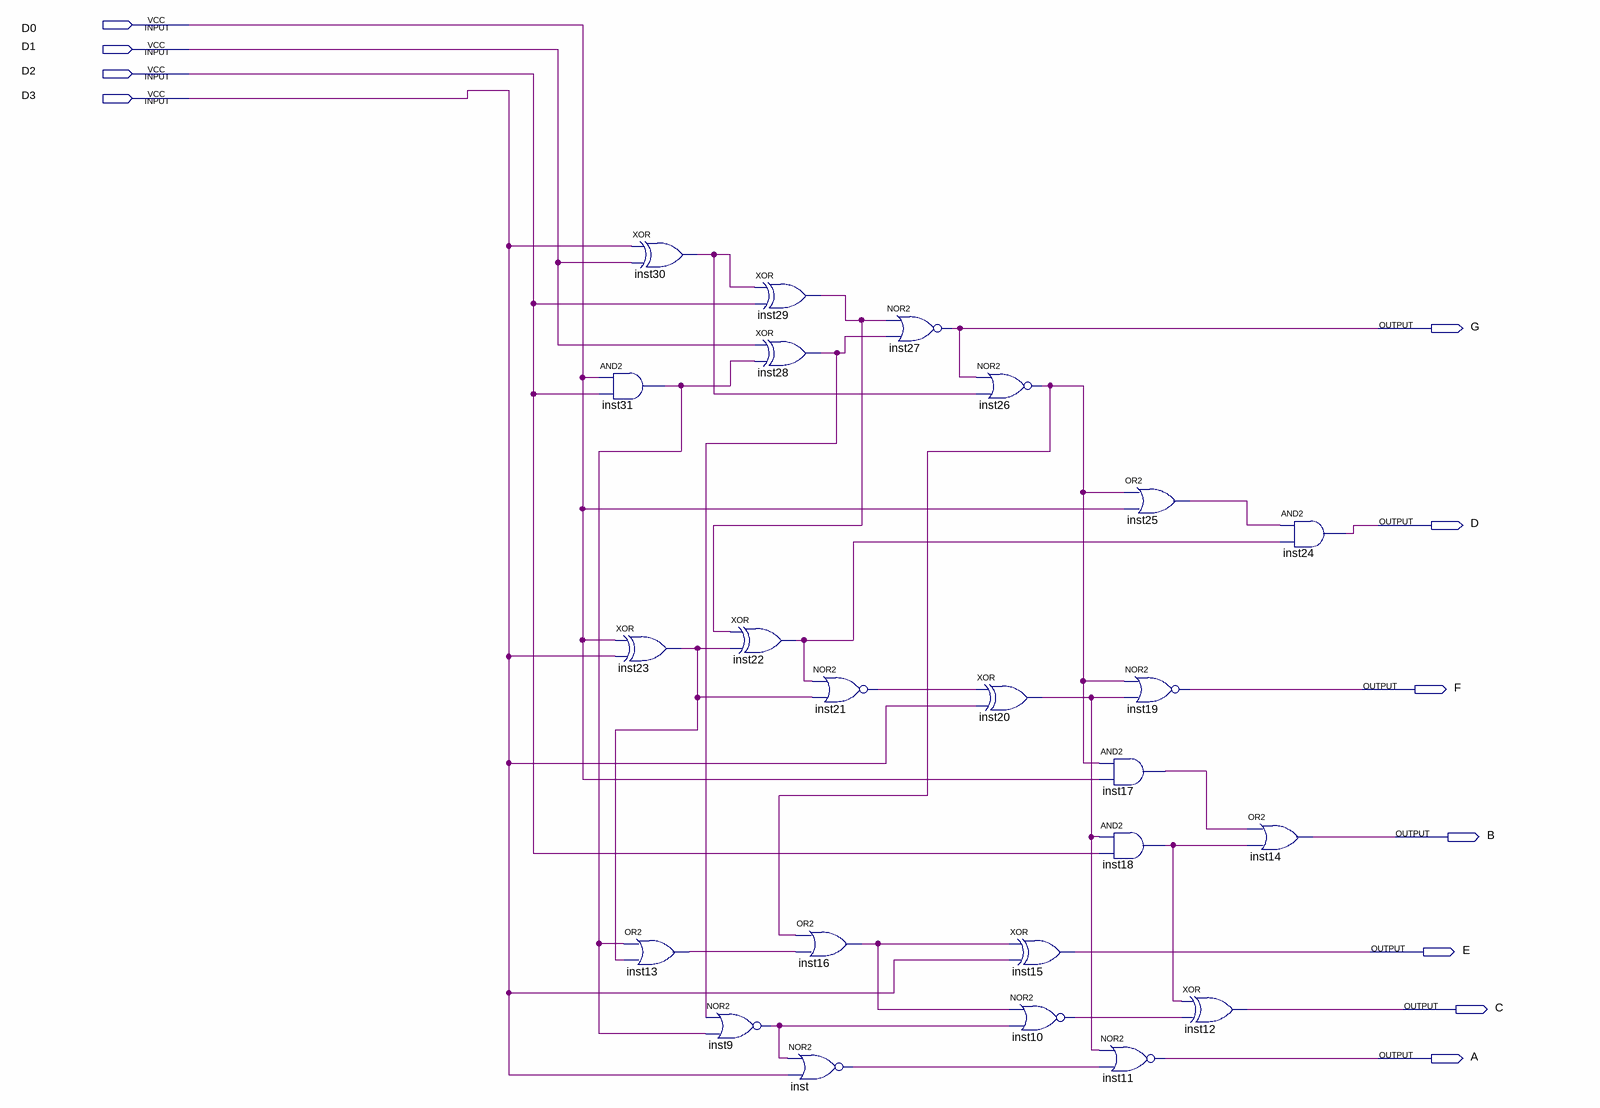
[diagram p0: schematic sheet]
// Quartus schematic HEX_7SegD.bdf as structural Verilog: 24 symbols, 11 pins
module HEX_7SegD (
  input  D0,
  input  D1,
  input  D2,
  input  D3,
  output G,
  output D,
  output F,
  output B,
  output E,
  output C,
  output A
);

  wire inst9_out, inst10_out, inst13_out, inst16_out, inst17_out, inst18_out, inst20_out, inst21_out,
       inst22_out, inst23_out, inst25_out, inst26_out, inst28_out, inst29_out, inst30_out, inst31_out,
       inst_out;

  and inst31 (inst31_out, D0, D2);
  xor inst23 (inst23_out, D0, D3);
  xor inst30 (inst30_out, D3, D1);
  or inst13 (inst13_out, inst31_out, inst23_out);
  xor inst22 (inst22_out, inst29_out, inst23_out);
  nor inst9 (inst9_out, inst28_out, inst31_out);
  xor inst29 (inst29_out, inst30_out, D2);
  xor inst28 (inst28_out, D1, inst31_out);
  nor inst21 (inst21_out, inst22_out, inst23_out);
  or inst16 (inst16_out, inst26_out, inst13_out);
  nor inst (inst_out, inst9_out, D3);
  nor inst27 (G, inst29_out, inst28_out);
  nor inst26 (inst26_out, G, inst30_out);
  xor inst20 (inst20_out, inst21_out, D3);
  xor inst15 (E, inst16_out, D3);
  nor inst10 (inst10_out, inst16_out, inst9_out);
  or inst25 (inst25_out, inst26_out, D0);
  nor inst19 (F, inst26_out, inst20_out);
  and inst17 (inst17_out, inst26_out, D0);
  and inst18 (inst18_out, inst20_out, D2);
  nor inst11 (A, inst20_out, inst_out);
  xor inst12 (C, inst18_out, inst10_out);
  or inst14 (B, inst17_out, inst18_out);
  and inst24 (D, inst25_out, inst22_out);
endmodule
